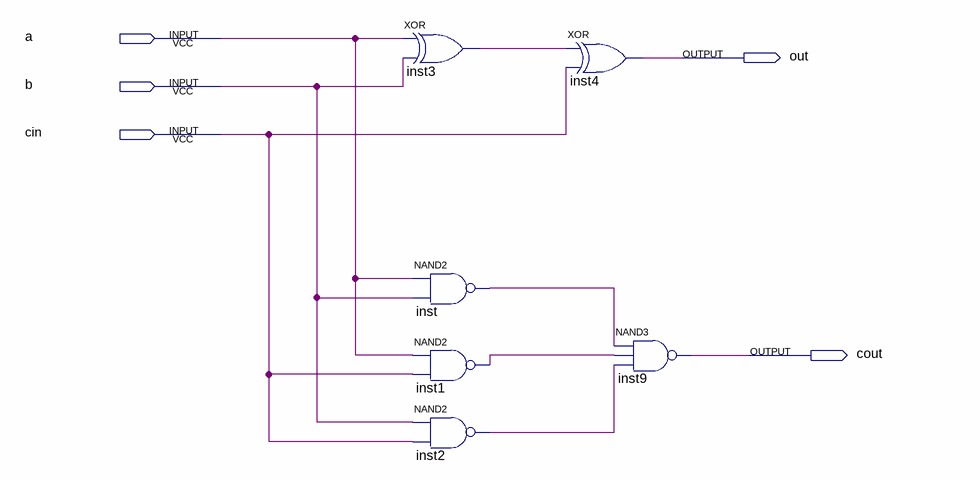
[diagram p0: schematic sheet]
// Quartus schematic somador1bit.bdf as structural Verilog: 6 symbols, 5 pins
module somador1bit (
  input  a,
  input  b,
  input  cin,
  output out,
  output cout
);

  wire inst1_out, inst2_out, inst3_out, inst_out;

  xor inst3 (inst3_out, a, b);
  nand inst (inst_out, a, b);
  nand inst1 (inst1_out, a, cin);
  nand inst2 (inst2_out, b, cin);
  xor inst4 (out, inst3_out, cin);
  nand inst9 (cout, inst_out, inst1_out, inst2_out);
endmodule
